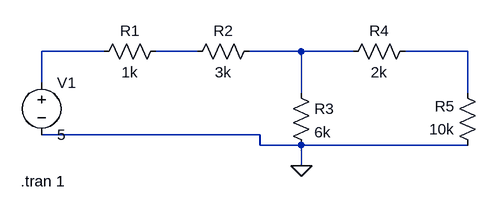
[diagram p0: schematic chance_reyes_Figure13.asc]
chance_reyes_Figure13.asc, the LTspice schematic file:
Version 4
SHEET 1 880 680
WIRE 128 80 32 80
WIRE 272 80 208 80
WIRE 432 80 352 80
WIRE 512 80 432 80
WIRE 688 80 592 80
WIRE 32 128 32 80
WIRE 432 144 432 80
WIRE 688 144 688 80
WIRE 368 208 32 208
WIRE 368 224 368 208
WIRE 432 224 368 224
WIRE 688 224 432 224
WIRE 432 256 432 224
FLAG 432 256 0
SYMBOL voltage 32 112 R0
WINDOW 123 0 0 Left 0
WINDOW 39 0 0 Left 0
SYMATTR InstName V1
SYMATTR Value 5
SYMBOL res 224 64 R90
WINDOW 0 0 56 VBottom 2
WINDOW 3 32 56 VTop 2
SYMATTR InstName R1
SYMATTR Value 1k
SYMBOL res 368 64 R90
WINDOW 0 0 56 VBottom 2
WINDOW 3 32 56 VTop 2
SYMATTR InstName R2
SYMATTR Value 3k
SYMBOL res 416 128 R0
SYMATTR InstName R3
SYMATTR Value 6k
SYMBOL res 608 64 R90
WINDOW 0 0 56 VBottom 2
WINDOW 3 32 56 VTop 2
SYMATTR InstName R4
SYMATTR Value 2k
SYMBOL res 704 240 R180
WINDOW 0 36 76 Left 2
WINDOW 3 36 40 Left 2
SYMATTR InstName R5
SYMATTR Value 10k
TEXT 0 280 Left 2 !.tran 1

The netlist it stands for:
* chance_reyes_Figure13.asc
V1 N001 0 5
R1 N002 N001 1k
R2 N003 N002 3k
R3 N003 0 6k
R4 N004 N003 2k
R5 0 N004 10k
.tran 1
.backanno
.end